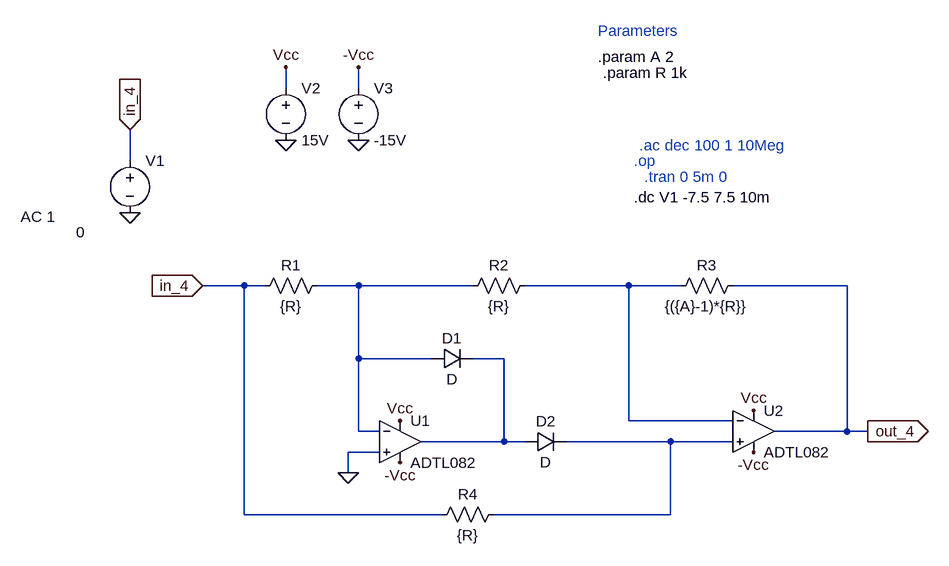
[diagram p0: schematic etaj4.asc]
etaj4.asc, the LTspice schematic file:
Version 4
SHEET 1 1392 680
WIRE 256 -224 256 -256
WIRE 368 -224 368 -256
WIRE 16 -112 16 -160
WIRE 192 80 128 80
WIRE 224 80 192 80
WIRE 368 80 304 80
WIRE 544 80 368 80
WIRE 784 80 624 80
WIRE 864 80 784 80
WIRE 1120 80 944 80
WIRE 368 192 368 80
WIRE 480 192 368 192
WIRE 592 192 544 192
WIRE 784 288 784 80
WIRE 944 288 784 288
WIRE 368 304 368 192
WIRE 400 304 368 304
WIRE 1120 304 1120 80
WIRE 1120 304 1008 304
WIRE 1152 304 1120 304
WIRE 592 320 592 192
WIRE 592 320 464 320
WIRE 624 320 592 320
WIRE 848 320 688 320
WIRE 944 320 848 320
WIRE 400 336 352 336
WIRE 352 368 352 336
WIRE 192 432 192 80
WIRE 496 432 192 432
WIRE 848 432 848 320
WIRE 848 432 576 432
FLAG 352 368 0
FLAG 368 -144 0
FLAG 256 -144 0
FLAG 256 -256 Vcc
FLAG 368 -256 -Vcc
FLAG 432 288 Vcc
FLAG 976 272 Vcc
FLAG 976 336 -Vcc
FLAG 432 352 -Vcc
FLAG 1152 304 out_4
IOPIN 1152 304 Out
FLAG 16 -32 0
FLAG 16 -160 in_4
IOPIN 16 -160 In
FLAG 128 80 in_4
IOPIN 128 80 In
SYMBOL voltage 16 -128 R0
WINDOW 3 -83 126 Left 2
WINDOW 123 -168 102 Left 2
WINDOW 39 0 0 Left 0
SYMATTR Value 0
SYMATTR Value2 AC 1
SYMATTR InstName V1
SYMBOL res 320 64 R90
WINDOW 0 0 56 VBottom 2
WINDOW 3 32 56 VTop 2
SYMATTR InstName R1
SYMATTR Value {R}
SYMBOL res 640 64 R90
WINDOW 0 0 56 VBottom 2
WINDOW 3 32 56 VTop 2
SYMATTR InstName R2
SYMATTR Value {R}
SYMBOL res 960 64 R90
WINDOW 0 0 56 VBottom 2
WINDOW 3 32 56 VTop 2
SYMATTR InstName R3
SYMATTR Value {({A}-1)*{R}}
SYMBOL OpAmps\\ADTL082 432 256 R0
SYMATTR InstName U1
SYMBOL OpAmps\\ADTL082 976 240 R0
SYMATTR InstName U2
SYMBOL diode 480 208 R270
WINDOW 0 32 32 VTop 2
WINDOW 3 0 32 VBottom 2
SYMATTR InstName D1
SYMBOL diode 624 304 M90
WINDOW 0 0 32 VBottom 2
WINDOW 3 32 32 VTop 2
SYMATTR InstName D2
SYMBOL res 592 416 R90
WINDOW 0 0 56 VBottom 2
WINDOW 3 32 56 VTop 2
SYMATTR InstName R4
SYMATTR Value {R}
SYMBOL voltage 256 -240 R0
WINDOW 123 0 0 Left 2
WINDOW 39 0 0 Left 2
SYMATTR InstName V2
SYMATTR Value 15V
SYMBOL voltage 368 -240 R0
WINDOW 123 0 0 Left 2
WINDOW 39 0 0 Left 2
SYMATTR InstName V3
SYMATTR Value -15V
TEXT 736 -312 Left 2 ;Parameters
TEXT 736 -272 Left 2 !.param A 2
TEXT 792 -112 Left 2 ;.op
TEXT 744 -248 Left 2 !.param R 1k
TEXT 800 -136 Left 2 ;.ac dec 100 1 10Meg
TEXT 808 -88 Left 2 ;.tran 0 5m 0
TEXT 792 -56 Left 2 !.dc V1 -7.5 7.5 10m

The netlist it stands for:
* etaj4.asc
V1 in_4 0 0 AC 1
R1 N001 in_4 {R}
R2 N002 N001 {R}
R3 out_4 N002 {({A}-1)*{R}}
XU1 0 N001 Vcc -Vcc N003 ADTL082  ; pins In+ In- V+ V- OUT
XU2 N004 N002 Vcc -Vcc out_4 ADTL082  ; pins In+ In- V+ V- OUT
D1 N001 N003 D
D2 N003 N004 D
R4 N004 in_4 {R}
V2 Vcc 0 15V
V3 -Vcc 0 -15V
.model D D
.lib standard.dio
* Parameters
.param A 2
* .op
.param R 1k
* .ac dec 100 1 10Meg
* .tran 0 5m 0
.dc V1 -7.5 7.5 10m
.lib ADI.lib
.backanno
.end

* Results of the author's LTspice run, read from the files saved beside the schematic
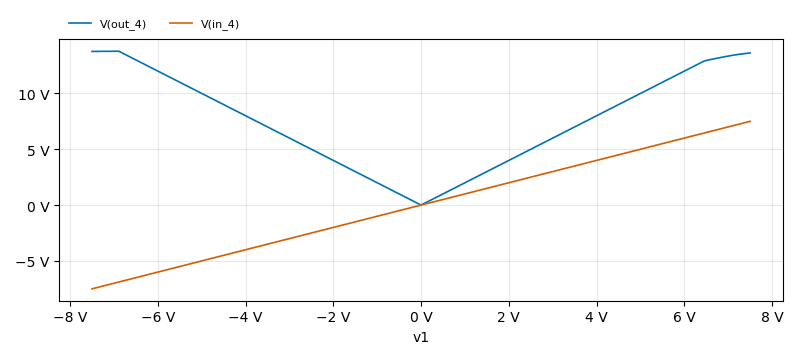
[diagram p1: DC transfer characteristic of etaj4.asc, plotted from the saved traces]
* DC transfer characteristic, 1 run:
*   V(out_4): 13.76 V at v1=-7.5 V, 13.62 V at v1=7.5 V, min 1.742 pV, max 13.78 V
*   V(in_4): -7.5 V at v1=-7.5 V, 7.5 V at v1=7.5 V, min -7.5 V, max 7.5 V